# EAGLE schematic rencarmon (EAGLE 8.3.1)
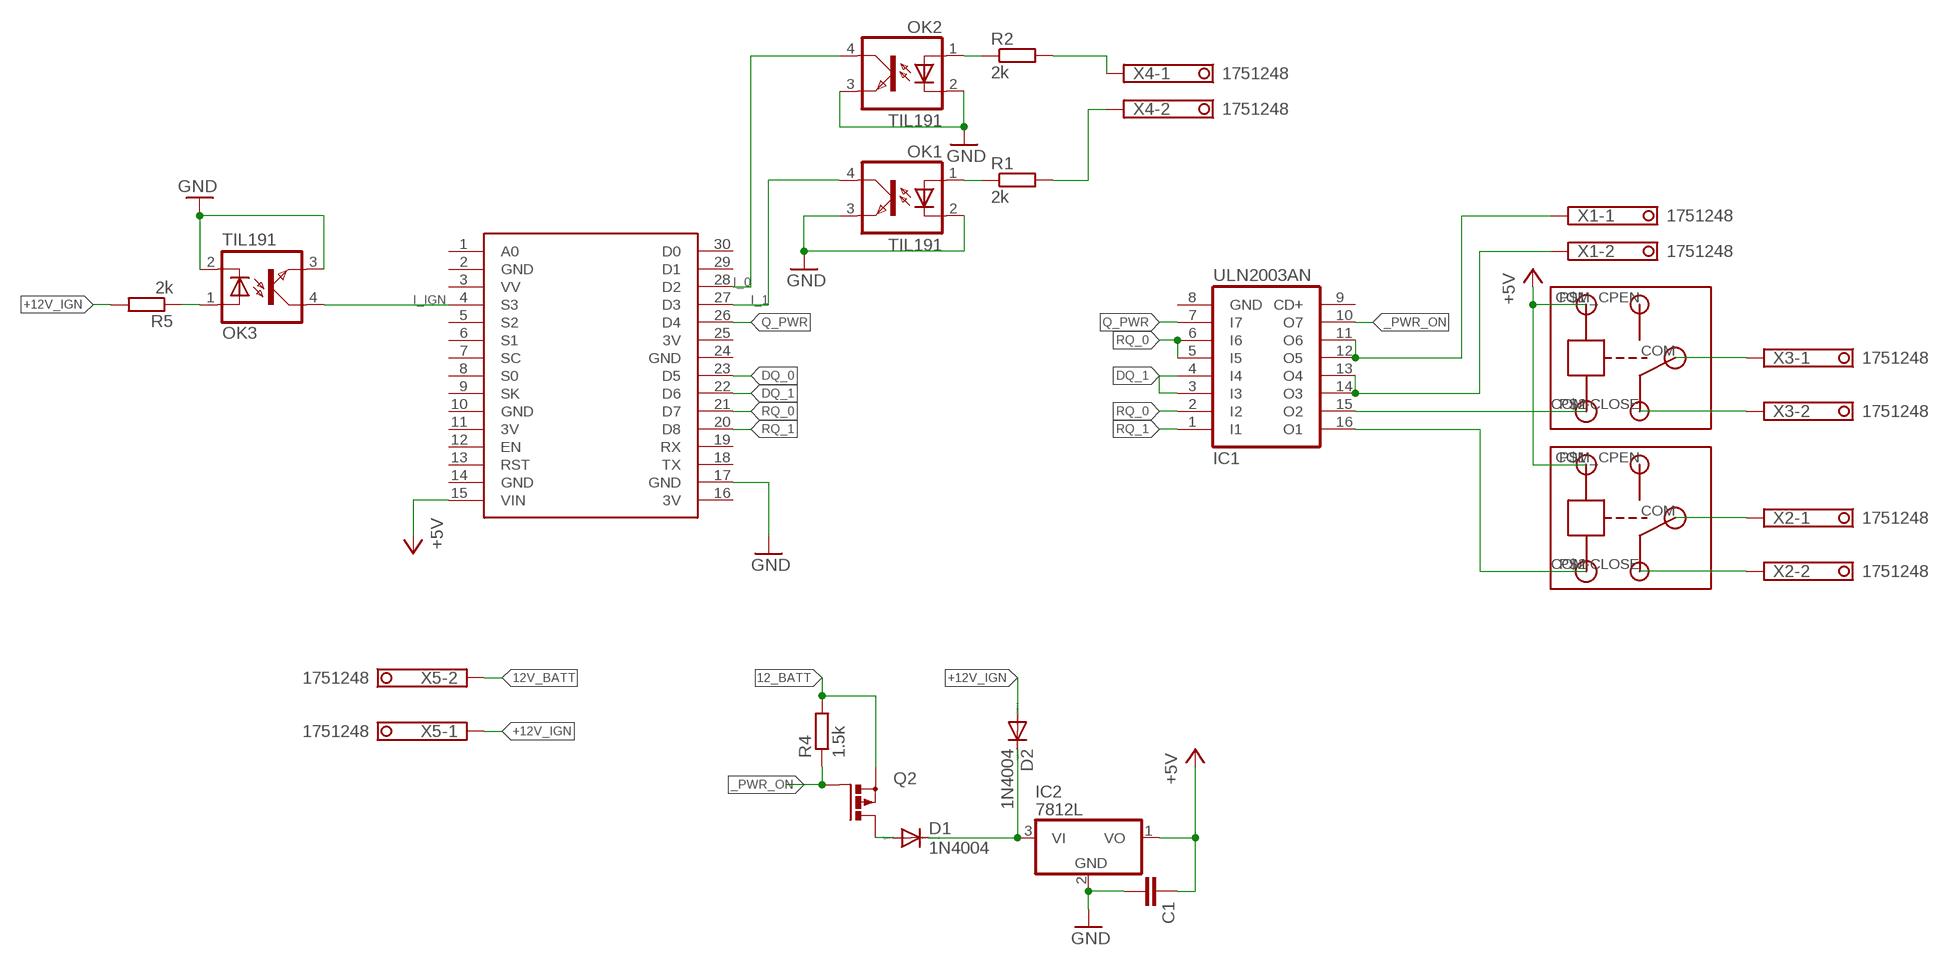
[diagram p0: schematic, sheet 1]

## Parts
C1  C2,5-3  [C2.5-3]
D1  1N4004  [DO41-10]
D2  1N4004  [DO41-10]
IC1  ULN2003AN  [DIL16]
IC2  7812L  [TO92]
OK1  TIL191  [DIL04]
OK2  TIL191  [DIL04]
OK3  TIL191  [DIL04]
Q2  PMOSFET_PTO220BV  [TO220BV]
R1  2k  R-EU_0207/5V  [0207/5V]
R2  2k  R-EU_0207/5V  [0207/5V]
R4  1.5k  R-EU_0207/5V  [0207/5V]
R5  2k  R-EU_0207/5V  [0207/5V]
U$1  NODEMCU  [NODEMCU]
U$2  RELAY  [RELAY]
U$3  RELAY  [RELAY]
X1  1751248  [1751248]
X2  1751248  [1751248]
X3  1751248  [1751248]
X4  1751248  [1751248]
X5  1751248  [1751248]

## Nets
12_BATT: Q2.S R4.2
12V_BATT: X5.2
+5V: C1.1 IC2.1(VO) U$1.15(VIN) U$2.P$1(IN) U$3.P$1(IN)
+12V_IGN: D2.A R5.2 X5.1
_PWR_ON: IC1.10(O7) Q2.G R4.1
DQ_0: U$1.23(D5)
DQ_1: IC1.3(I3) IC1.4(I4) U$1.22(D6)
GND: C1.2 IC2.2(GND) OK1.2(C) OK1.3(EMIT) OK2.2(C) OK2.3(EMIT) OK3.2(C) OK3.3(EMIT) U$1.17(GND)
I_0: OK2.4(COL) U$1.28(D2)
I_1: OK1.4(COL) U$1.27(D3)
I_IGN: OK3.4(COL) U$1.4(S3)
N$1: D1.A Q2.D
N$6: IC1.16(O1) U$3.P$2(GND)
N$7: R2.2 X4.1
N$8: R1.2 X4.2
N$9: IC1.15(O2) U$2.P$2(GND)
N$11: U$3.COM X2.1
N$12: U$3.COM-CLOSE X2.2
N$13: U$2.COM-CLOSE X3.2
N$14: U$2.COM X3.1
N$15: IC1.13(O4) IC1.14(O3) X1.2
N$16: IC1.11(O6) IC1.12(O5) X1.1
N$17: OK1.1(A) R1.1
N$18: OK2.1(A) R2.1
N$20: D1.C D2.C IC2.3(VI)
N$23: OK3.1(A) R5.1
Q_PWR: IC1.7(I7) U$1.26(D4)
RQ_0: IC1.2(I2) IC1.5(I5) IC1.6(I6) U$1.21(D7)
RQ_1: IC1.1(I1) U$1.20(D8)
Unconnected: IC1.9(CD+) U$1.1(A0) U$1.3(VV) U$1.5(S2) U$1.6(S1) U$1.7(SC) U$1.8(S0) U$1.9(SK) U$1.12(EN) U$1.13(RST) U$1.18(TX) U$1.19(RX) U$1.29(D1) U$1.30(D0) U$2.COM_CPEN(COM-OPEN) U$3.COM_CPEN(COM-OPEN)

## Power pins joined to a net without a drawn wire
3V: U$1.11(3V) U$1.16(3V) U$1.25(3V)
GND: IC1.8(GND) U$1.2(GND) U$1.10(GND) U$1.14(GND) U$1.24(GND)

## Library data of the parts
C1 = capacitor-wima:C: CAPACITOR naming: grid - package width
D1 D2 = diode:1N4004: DIODE general purpose rectifier, 1 A
IC1 = uln-udn:ULN2003A: DRIVER ARRAY
IC2 = linear:78*: Positive VOLTAGE REGULATOR Source: http://cache.national.com/ds/LM/LM78L05.pdf http://www.fairchildsemi.com/ds/LM/LM7805.pdf
OK1-OK3 = optocoupler:TIL191: TEXAS INSTRUMENTS OPTO COUPLER; OC_FARNELL: 1683363; OC_NEWARK: unknown
Q2 = transistor-power:PMOSFET_P: Power MOSFET P-Channel
R1 R2 R4 R5 = resistor:R-EU_: RESISTOR, European symbol
U$1 = nodemcu:NODEMCU
U$2 U$3 = RELAY:RELAY
X1-X5 = con-phoenix-350:1751248: MKDS 1/ 2-3,5 Printklemme Nennstrom: 10 A Bemessungsspannung: 160 V Raster: 3,5 mm Polzahl: 2 Montageart: Löten Anschlussart: Schraubanschluss Anschlussrichtung vom Leiter zur Platine: 0° Source: http://eshop.phoenixcontact.com .. 1751248.pdf; OC_FARNELL: unknown; OC_NEWARK: unknown